# Altium schematic sheet OpticDiodes+LEDs.SchDoc
size A3
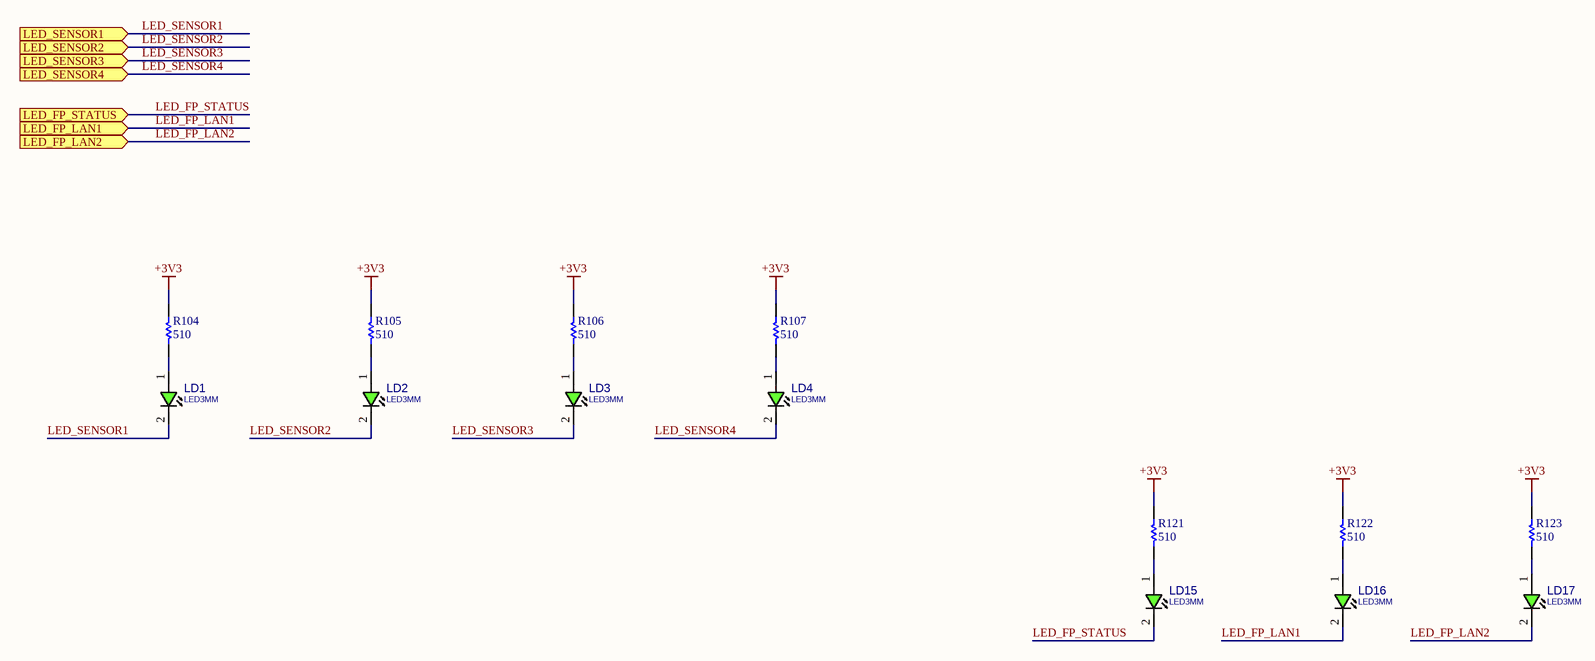
[diagram p0: OpticDiodes+LEDs.SchDoc]

## Parts
LD1  LED3MM  [LED3MM]
LD2  LED3MM  [LED3MM]
LD3  LED3MM  [LED3MM]
LD4  LED3MM  [LED3MM]
LD15  LED3MM  [LED3MM]
LD16  LED3MM  [LED3MM]
LD17  LED3MM  [LED3MM]
R104  510  [R0603E]
R105  510  [R0603E]
R106  510  [R0603E]
R107  510  [R0603E]
R121  510  [R0603E]
R122  510  [R0603E]
R123  510  [R0603E]

## Ports
LED_FP_LAN1 (in), LED_FP_LAN2 (in), LED_FP_STATUS (in), LED_SENSOR1 (in), LED_SENSOR2 (in), LED_SENSOR3 (in), LED_SENSOR4 (in)

## Nets
+3V3: R104.1 R105.1 R106.1 R107.1 R121.1 R122.1 R123.1
LED_FP_LAN1: LD16.2(CATHODE) ; port LED_FP_LAN1
LED_FP_LAN2: LD17.2(CATHODE) ; port LED_FP_LAN2
LED_FP_STATUS: LD15.2(CATHODE) ; port LED_FP_STATUS
LED_SENSOR1: LD1.2(CATHODE) ; port LED_SENSOR1
LED_SENSOR2: LD2.2(CATHODE) ; port LED_SENSOR2
LED_SENSOR3: LD3.2(CATHODE) ; port LED_SENSOR3
LED_SENSOR4: LD4.2(CATHODE) ; port LED_SENSOR4
NetLD1_1: LD1.1(ANODE) R104.2
NetLD2_1: LD2.1(ANODE) R105.2
NetLD3_1: LD3.1(ANODE) R106.2
NetLD4_1: LD4.1(ANODE) R107.2
NetLD15_1: LD15.1(ANODE) R121.2
NetLD16_1: LD16.1(ANODE) R122.2
NetLD17_1: LD17.1(ANODE) R123.2

## Library data of the parts
LD1-LD4 LD15-LD17 = LED_THD_3MM: LED, THD, 3MM, GREEN; DESC: DESCRIPTION; MANF_P#: MANF_PART#; PARAM2: 2.2V; MANF: MANF; ASSEMBLY: ASSEMBLY; PRICE: PRICE; VALUE: LED3MM
R104-R107 R121-R123 = Res1: Resistor: thick film; SMD; Manufacturer: Vishay or Panasonic; Manufacturer Part Number: NULL; Board Qty: 1000; Current Footprint: 0603 (1608 Metric); Value: 4.7KR; PCB Name: GS-101; ITEM/NO: 15; Part Number: 510; ComponentLink1Description: Datasheet; ComponentLink1URL: D:\HNA\Datasheet Documents\Resistor-Chip-UniOhm.pdf; Description1: Resistor: thick film; SMD; HelpURL: D:\HNA\Datasheet Documents\Resistor-Chip-UniOhm.pdf; Mounting Type: Surface Mount, MLCC; Package / Case: 0603 (1608 Metric); Pricing: NULL; Supplier: NULL; Supplier Part Number: NULL; Size / Dimension: NULL